# EAGLE schematic glbl2 (EAGLE 9.6.2)
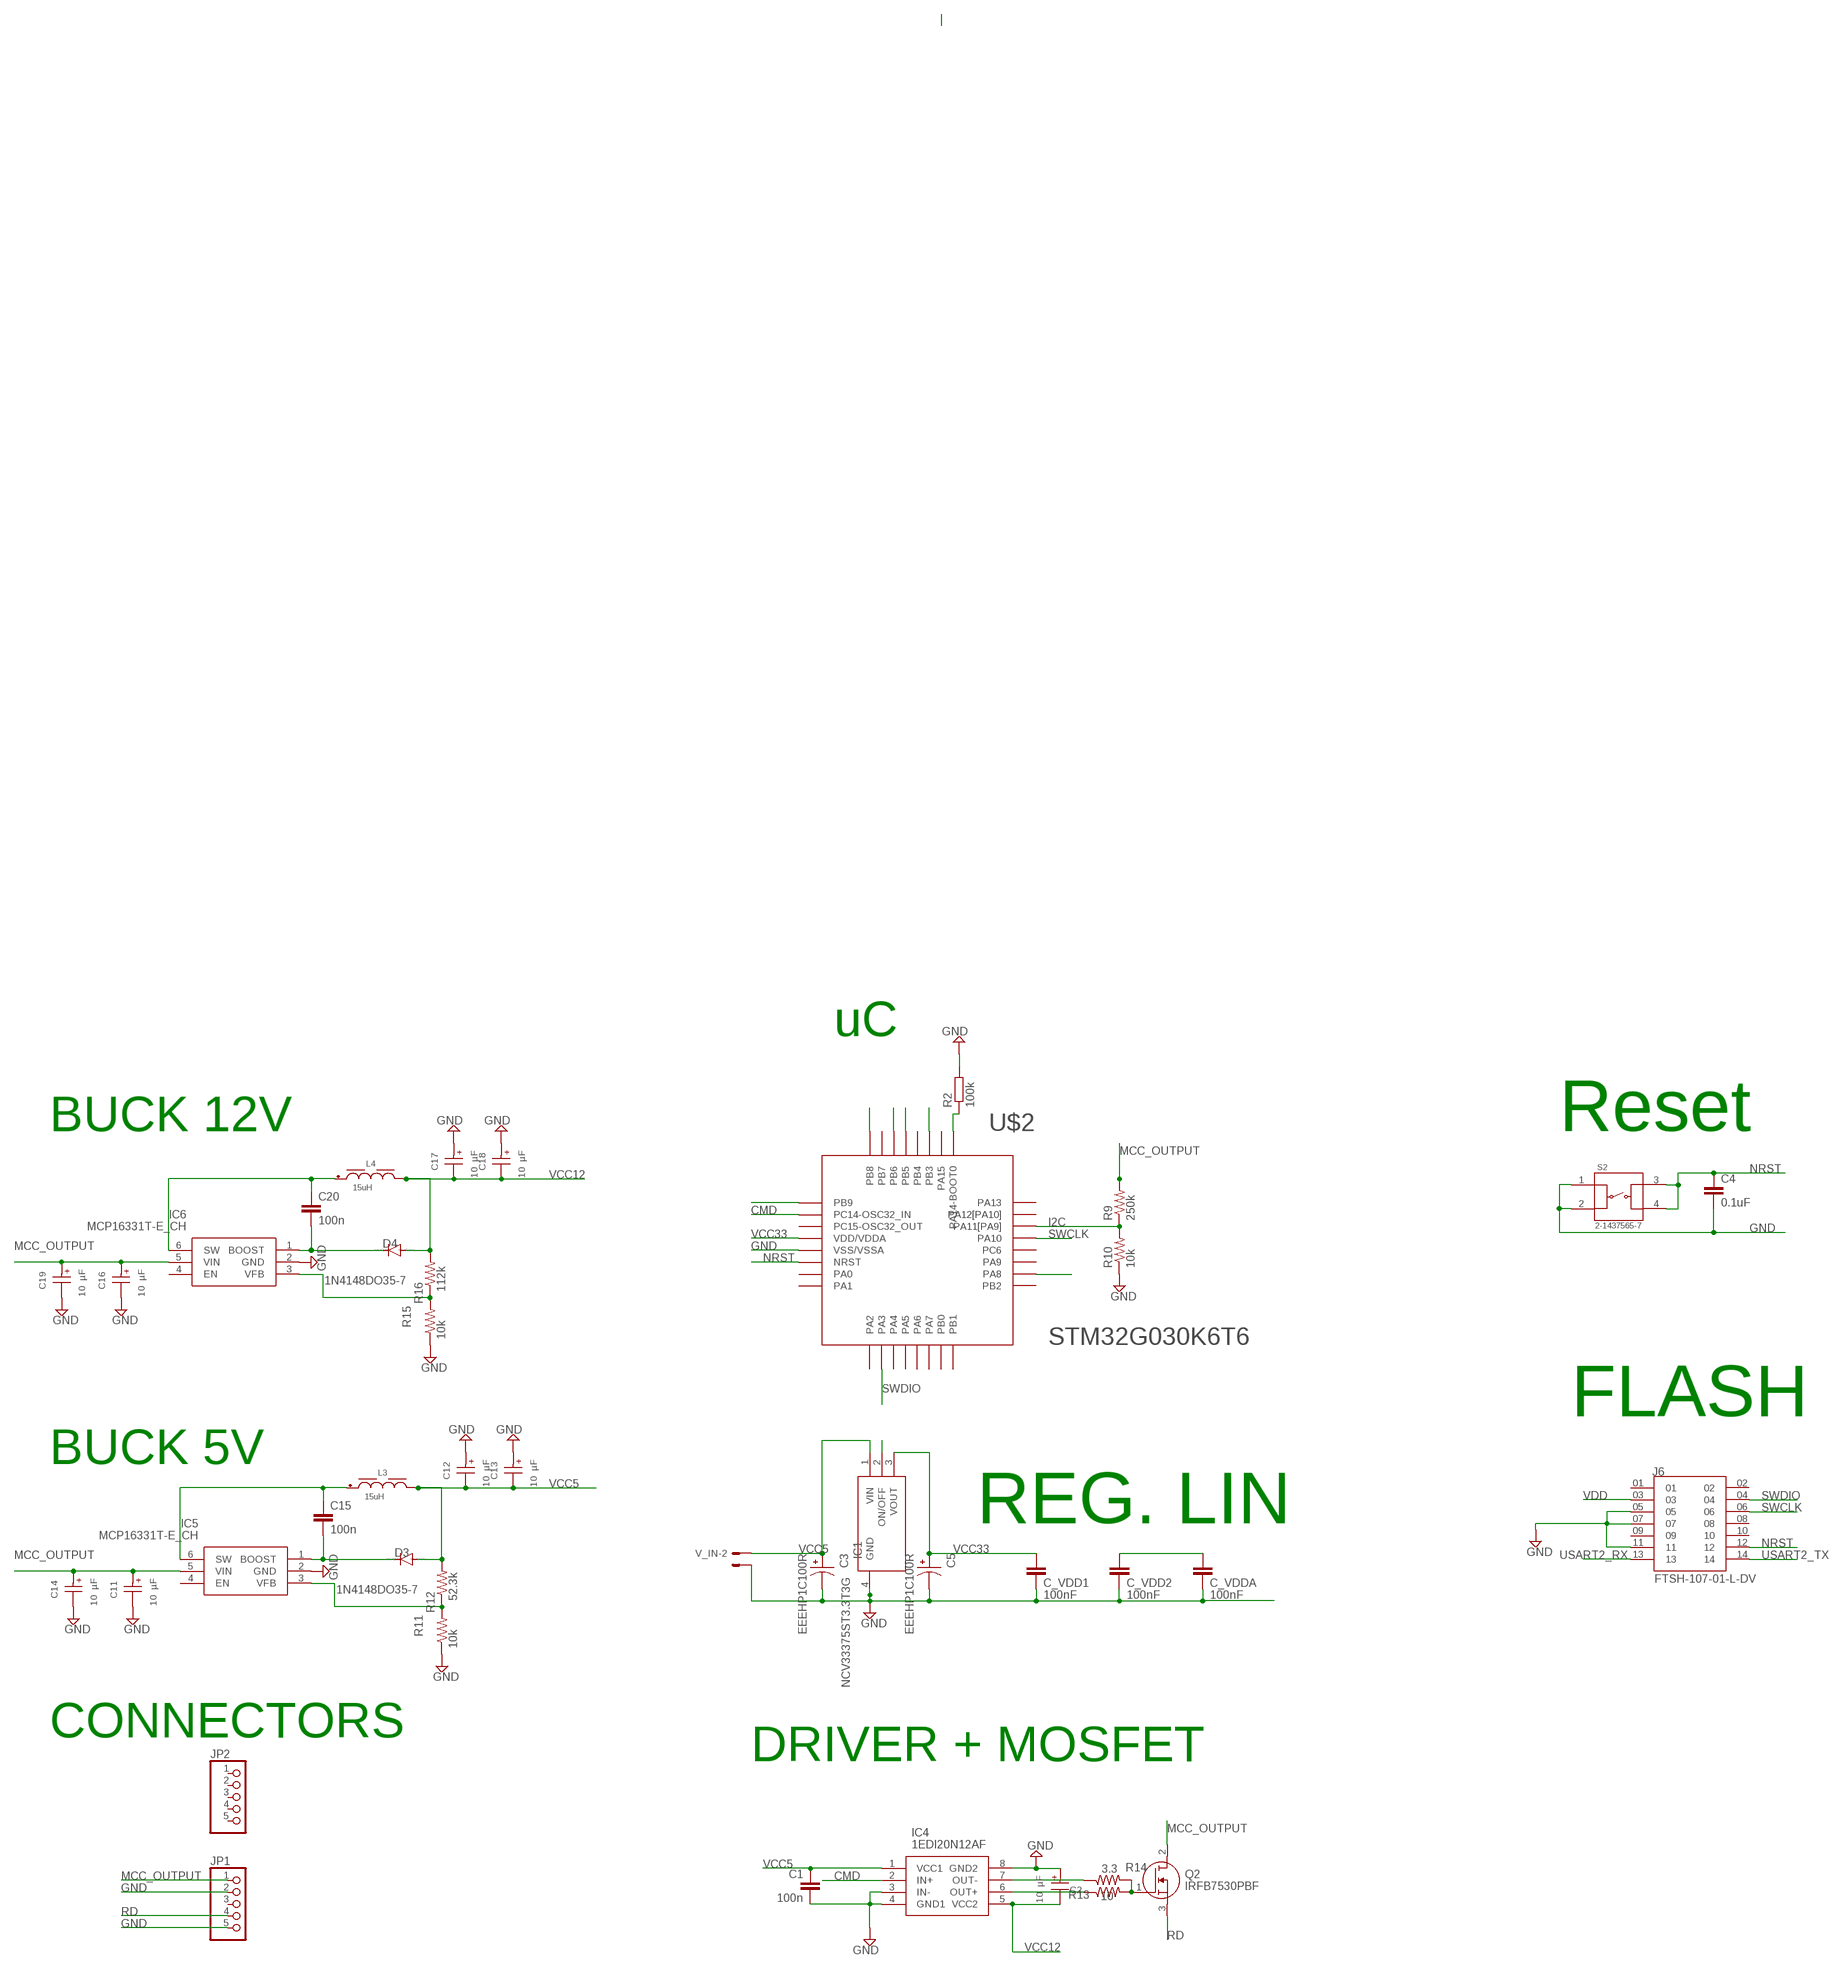
[diagram p0: schematic, sheet 1]

## Parts
C1  100n  C-EUC0805  [C0805]
C2  10 µF  WCAP-ASLI_6.3X7.7_865080845005  [WCAP-ASLI_6.3X7.7(DXL)]
C3  EEEHP1C100R  [CAP_EEEHP1C100R]
C4  0.1uF  C-EUC0603  [C0603]
C5  EEEHP1C100R  [CAP_EEEHP1C100R]
C11  10 µF  WCAP-ASLI_6.3X7.7_865080845005  [WCAP-ASLI_6.3X7.7(DXL)]
C12  10 µF  WCAP-ASLI_6.3X7.7_865080845005  [WCAP-ASLI_6.3X7.7(DXL)]
C13  10 µF  WCAP-ASLI_6.3X7.7_865080845005  [WCAP-ASLI_6.3X7.7(DXL)]
C14  10 µF  WCAP-ASLI_6.3X7.7_865080845005  [WCAP-ASLI_6.3X7.7(DXL)]
C15  100n  C-EUC0805  [C0805]
C16  10 µF  WCAP-ASLI_6.3X7.7_865080845005  [WCAP-ASLI_6.3X7.7(DXL)]
C17  10 µF  WCAP-ASLI_6.3X7.7_865080845005  [WCAP-ASLI_6.3X7.7(DXL)]
C18  10 µF  WCAP-ASLI_6.3X7.7_865080845005  [WCAP-ASLI_6.3X7.7(DXL)]
C19  10 µF  WCAP-ASLI_6.3X7.7_865080845005  [WCAP-ASLI_6.3X7.7(DXL)]
C20  100n  C-EUC0805  [C0805]
C_VDD1  100nF  C-EUC0603  [C0603]
C_VDD2  100nF  C-EUC0603  [C0603]
C_VDDA  100nF  C-EUC0603  [C0603]
D3  1N4148DO35-7  [DO35-7]
D4  1N4148DO35-7  [DO35-7]
IC1  NCV33375ST3.3T3G  [SOT230P700X175-4N]
IC4  1EDI20N12AF  [SOIC127P600X175-8N]
IC5  MCP16331T-E_CH  [SOT95P280X145-6N]
IC6  MCP16331T-E_CH  [SOT95P280X145-6N]
J6  FTSH-107-01-L-DV  [SAMTEC_FTSH-107-01-L-DV]
JP1  PINHD-1X5  [1X05]
JP2  PINHD-1X5  [1X05]
L3  15uH  WE-PD_7345R_7447779115  [WE-PD_7345R]
L4  15uH  WE-PD_7345R_7447779115  [WE-PD_7345R]
Q2  IRFB7530PBF  [TO254P483X1016X1994-3P]
R2  100k  R-EU_R0603  [R0603]
R9  250k  R-US_R0603  [R0603]
R10  10k  R-US_R0603  [R0603]
R11  10k  R-US_R0603  [R0603]
R12  52.3k  R-US_R0603  [R0603]
R13  10  R-US_R0603  [R0603]
R14  3.3  R-US_R0603  [R0603]
R15  10k  R-US_R0603  [R0603]
R16  112k  R-US_R0603  [R0603]
S2  2-1437565-7  [SW_2-1437565-7]
U$2  STM32G030K6T6  [QFP32_STM32]
V_IN  22-23-2021  [22-23-2021]

## Nets
CMD: IC4.2(IN+) U$2.2(PC14-OSC32_IN)
GND: C2.1(+) C3.2 C4.2 C5.2 C11.2(-) C12.1(+) C13.1(+) C14.2(-) C16.2(-) C17.1(+) C18.1(+) C19.2(-) C_VDD1.2 C_VDD2.2 C_VDDA.2 IC1.4(GND) IC4.3(IN-) IC4.8(GND2) IC5.2(GND) IC6.2(GND) J6.05 J6.07 J6.11 JP1.2 JP1.5 R2.2 R10.1 R11.1 R15.1 S2.1 S2.2 U$2.5(VSS/VSSA) V_IN.1
I2C: R9.1 R10.2 U$2.22(PA11[PA9])
MCC_OUTPUT: C11.1(+) C14.1(+) C16.1(+) C19.1(+) IC5.5(VIN) IC6.5(VIN) JP1.1 Q2.2(D) R9.2
N$1: IC4.6(OUT+) R13.1
N$2: IC4.7(OUT-) R14.1
N$5: IC1.2(ON/OFF)
N$6: C_VDD2.1 C_VDDA.1
N$7: C1.2 IC4.4(GND1)
N$8: U$2.27(PB3)
N$9: U$2.32(PB8)
N$10: U$2.29(PB5)
N$11: U$2.30(PB6)
N$12: U$2.1(PB9)
N$14: U$2.18(PA8)
N$15: R2.1 U$2.25(PA14-BOOT0)
N$17: C15.1 IC5.6(SW) L3.1
N$18: Q2.1(G) R13.2 R14.2
N$21: C15.2 D3.C IC5.1(BOOST)
N$22: IC5.3(VFB) R11.2 R12.1
N$27: C20.1 IC6.6(SW) L4.1
N$29: C20.2 D4.C IC6.1(BOOST)
N$30: IC6.3(VFB) R15.2 R16.1
NRST: C4.1 J6.12 S2.3 S2.4 U$2.6(NRST)
RD: JP1.4 Q2.3(S)
SWCLK: J6.06 U$2.21(PA10)
SWDIO: J6.04 U$2.10(PA3)
USART2_RX: J6.13
USART2_TX: J6.14
VCC5: C1.1 C3.1 C12.2(-) C13.2(-) D3.A IC1.1(VIN) IC4.1(VCC1) L3.2 R12.2 V_IN.2
VCC12: C2.2(-) C17.2(-) C18.2(-) D4.A IC4.5(VCC2) L4.2 R16.2
VCC33: C5.1 C_VDD1.1 IC1.3(VOUT) U$2.4(VDD/VDDA)
VDD: J6.03
Unconnected: IC5.4(EN) IC6.4(EN) J6.01 J6.02 J6.08 J6.09 J6.10 JP1.3 JP2.1 JP2.2 JP2.3 JP2.4 JP2.5 U$2.3(PC15-OSC32_OUT) U$2.7(PA0) U$2.8(PA1) U$2.9(PA2) U$2.11(PA4) U$2.12(PA5) U$2.13(PA6) U$2.14(PA7) U$2.15(PB0) U$2.16(PB1) U$2.17(PB2) U$2.19(PA9) U$2.20(PC6) U$2.23(PA12[PA10]) U$2.24(PA13) U$2.26(PA15) U$2.28(PB4) U$2.31(PB7)

## Notes on the sheet
- uC
- BUCK 12V | Reset
- FLASH
- BUCK 5V
- REG. LIN
- CONNECTORS
- DRIVER + MOSFET

## Library data of the parts
C1 C4 C15 C20 C_VDD1 C_VDD2 C_VDDA = rcl:C-EU: CAPACITOR, European symbol; SPICEPREFIX: C
C2 C11-C14 C16-C19 = Eagle_WCAP-ASLI (rev20a):WCAP-ASLI_6.3X7.7: WCAP-ASLI Aluminium Electrolytic Capacitors Low Impedance +105 °C Characteristics Low impedance product series Mounting style: V-Chip SMT Capacitance range: 0.1 µF ‒ 6800 µF Capacitance tolerance: ±20 % Voltage range (UR): 6.3 ‒ 100 V(DC) Operating temperature: -55 °C up to +105 °C Endurance: 2000 h @ +105 °C Dimensions (DxL) in mm: 4.0 x 5.5 up to 16.0 x 17.0 Recommended soldering: Reflow soldering Applications Low impedance, especially for filtering applications Input and output capacitor for switched-mode power supply Filtering Smoothing e.g. DC/DC converter, AC/DC converter, satellite receiver, control panel <https://www.we-online.com/catalog/media/o14723v209%20Family_WCAP-ASLI.jpg> Details see: https://www.we-online.com/catalog/en/WCAP-ASLI/ Updated by yingchun,Shan;2020-03-03 2020(C) Würth Elektronik; DATASHEET-URL: https://www.we-online.com/catalog/datasheet/865080845005.pdf; DF: 10%; DIAMETER: 6.3mm; I-LEAK: 10uA; I-RIPPLE: 35mA; L: 7.7mm; OPERATING-TEMPERATURE: -55 °C up to +105 °C; PART-NUMBER: 865080845005; TECHNICAL-REFERENCE: ASED077100M100DVCTCB000; VR: 100V(DC)
C3 C5 = EEEHP1C100R:EEEHP1C100R: Check availability <https://pricing.snapeda.com/parts/EEEHP1C100R/Panasonic/view-part?ref=eda>; AVAILABILITY: In Stock; DESCRIPTION: Cap Aluminum Lytic 10uF 16V 20% (5 X 5.8mm) SMD 25mA 2000h 105C Automotive T/R; MF: Panasonic; MP: EEEHP1C100R; PACKAGE: RADIAL-2 Panasonic; PRICE: None; PURCHASE-URL: https://pricing.snapeda.com/search/part/EEEHP1C100R/?ref=eda
D3 D4 = diode:1N4148: DIODE high speed (Philips)
IC1 = NCV33375ST3.3T3G:NCV33375ST3.3T3G: ON SEMICONDUCTOR - NCV33375ST3.3T3G - Fixed LDO Voltage Regulator, 4.3V to 13V, 260mV Dropout, 3.3Vout, 300mAout, SOT-223-4 Source: Datasheet <http://www.onsemi.com/pub/Collateral/MC33375-D.PDF>; ARROW_PART_NUMBER: NCV33375ST3.3T3G; ARROW_PRICE-STOCK: https://www.arrow.com/en/products/ncv33375st3.3t3g/on-semiconductor?region=nac; DESCRIPTION: ON SEMICONDUCTOR - NCV33375ST3.3T3G - Fixed LDO Voltage Regulator, 4.3V to 13V, 260mV Dropout, 3.3Vout, 300mAout, SOT-223-4; HEIGHT: 1.75mm; MANUFACTURER_NAME: onsemi; MANUFACTURER_PART_NUMBER: NCV33375ST3.3T3G; MOUSER_PART_NUMBER: 863-NCV33375ST3.3T3G; MOUSER_PRICE-STOCK: https://www.mouser.co.uk/ProductDetail/ON-Semiconductor/NCV33375ST33T3G?qs=Pqj8oIac8rWOl%252BM3OwXrOg%3D%3D
IC4 = 1EDI20N12AF:1EDI20N12AF: Gate Drivers 1200V Isolated 1-CH, 3.5A,Separate Output Source: Datasheet <https://componentsearchengine.com/Datasheets/1/1EDI20N12AF.pdf>; DESCRIPTION: Gate Drivers 1200V Isolated 1-CH, 3.5A,Separate Output; HEIGHT: 1.75mm; MANUFACTURER_NAME: Infineon; MANUFACTURER_PART_NUMBER: 1EDI20N12AF; MOUSER_PART_NUMBER: 726-1EDI20N12AF; MOUSER_PRICE-STOCK: https://www.mouser.co.uk/ProductDetail/Infineon-Technologies/1EDI20N12AF?qs=Fdzd9GSp%252BASr8JSo1G1nbg%3D%3D
IC5 IC6 = MCP16331T-E_CH:MCP16331T-E_CH: 50V 500mA Adj. Switch Regulator SOT23-6 Microchip, MCP16331T-E/CH Step-Down Switching Regulator 1.2A Adjustable, 2 24 V, 6-Pin SOT-23 Source: Datasheet <http://ww1.microchip.com/downloads/en/DeviceDoc/20005308C.pdf>; ARROW_PART_NUMBER: MCP16331T-E/CH; ARROW_PRICE-STOCK: https://www.arrow.com/en/products/mcp16331t-ech/microchip-technology?region=nac; DESCRIPTION: 50V 500mA Adj. Switch Regulator SOT23-6 Microchip, MCP16331T-E/CH Step-Down Switching Regulator 1.2A Adjustable, 2 24 V, 6-Pin SOT-23; HEIGHT: 1.45mm; MANUFACTURER_NAME: Microchip; MANUFACTURER_PART_NUMBER: MCP16331T-E/CH; MOUSER_PART_NUMBER: 579-MCP16331T-E/CH; MOUSER_PRICE-STOCK: https://www.mouser.co.uk/ProductDetail/Microchip-Technology/MCP16331T-E-CH?qs=rQCxX1QmdjIpfF%2FjMAUv9A%3D%3D
J6 = FTSH-107-01-L-DV:FTSH-107-01-L-DV; MANUFACTURER: Samtec; PARTREV: R; STANDARD: Manufacturer Recommendations
JP1 JP2 = pinhead:PINHD-1X5: PIN HEADER
L3 L4 = Eagle_WE-PD (rev20a)(1):WE-PD_7345R: WE-PD SMT Power Inductor Characteristics AECQ 200 Qualified Ultra low RDC and RAC Highest possible saturation current based on Ferrite Suitable for switching frequency up to 10MHz Temperature dependent parameter available on Redexpert Operating Temperature from -40°C to +125°C / +150°C Types WE-PD: Since always with low loss material, tight tolerances and high saturation behavior compared to other manufacturers in the market WE-PD Robust: Plastic base improves the mechanical stability and efficiency WE-PD Performance: MnZn core improves Saturation and RDC for highest efficiency Applications Switch Mode Power supplies from 0,1W up to 300W Integrated DC DC Converter Ideal for Switch Mode Power supplies with extreme high efficiency (>95%) <https://www.we-online.com/catalog/media/o14825v209%20Family_WE-PD.jpg> Details see: https://www.we-online.com/catalog/en/WE-PD/ Updated by Yingchun,Shan 2019-07-25 2019 (C) Wurth Elektronik; DATASHEET-URL: https://www.we-online.com/catalog/datasheet/7447779115.pdf; FRES: 19.5MHz; IR: 1.6A; ISAT: 2.2A; MOUNT: SMT; PART-NUMBER: 7447779115; RDC-MAX: 81mOhm; RDC-TYP: 70mOhm; VERSION: Robust
Q2 = IRFB7530PBF:IRFB7530PBF: Infineon IRFB7530PBF N-channel MOSFET, 195 A, 60 V StrongIRFET, 3-Pin TO-220AB Source: Datasheet <https://www.infineon.com/dgdl/irfs7530pbf.pdf?fileId=5546d462533600a4015364c3d98429c3>; ARROW_PART_NUMBER: IRFB7530PBF; ARROW_PRICE-STOCK: https://www.arrow.com/en/products/irfb7530pbf/infineon-technologies-ag; DESCRIPTION: Infineon IRFB7530PBF N-channel MOSFET, 195 A, 60 V StrongIRFET, 3-Pin TO-220AB; HEIGHT: 4.83mm; MANUFACTURER_NAME: Infineon; MANUFACTURER_PART_NUMBER: IRFB7530PBF; MOUSER_PART_NUMBER: 942-IRFB7530PBF; MOUSER_PRICE-STOCK: https://www.mouser.co.uk/ProductDetail/Infineon-IR/IRFB7530PBF?qs=a7rcPCEf1Q%2FFGrR%252BNclv%2FQ%3D%3D
R2 = rcl:R-EU_: RESISTOR, European symbol; SPICEPREFIX: R
R9-R16 = rcl:R-US_: RESISTOR, American symbol; SPICEPREFIX: R
S2 = 2-1437565-7:2-1437565-7: FSM2JSMA=SMT,TACTILE,PB SWITCH Check availability <https://pricing.snapeda.com/parts/FSM2JSMA/TE%20Connectivity/view-part?ref=eda>; AVAILABILITY: In Stock; COMMENT: 2-1437565-7; CONFIGURATION_POLE-THROW: Single Pole - Single Throw; CONTACT_CURRENT_RATING: 50 mA; DESCRIPTION: Tactile Switch SPST-NO Top Actuated Surface Mount; MF: TE Connectivity; MP: FSM2JSMA; PACKAGE: None; PRICE: None; PURCHASE-URL: https://pricing.snapeda.com/search/part/FSM2JSMA/?ref=eda
U$2 = STM32G030K6T6:STM32G030K6T6: STM32G030K6T6 32 pins LQFP Check availability <https://pricing.snapeda.com/parts/STM32G030K6T6/STMicroelectronics/view-part?ref=eda>; AVAILABILITY: In Stock; DESCRIPTION: ARM® Cortex®-M0+ series Microcontroller IC 32-Bit Single-Core 64MHz 32KB (32K x 8) FLASH 32-LQFP (7x7); MF: STMicroelectronics; MP: STM32G030K6T6; PACKAGE: LQFP-32 STMicroelectronics; PRICE: None; PURCHASE-URL: https://pricing.snapeda.com/search/part/STM32G030K6T6/?ref=eda
V_IN = con-molex:22-23-2021: .100" (2.54mm) Center Header - 2 Pin; MF: MOLEX; MPN: 22-23-2021; OC_FARNELL: 1462926; OC_NEWARK: 25C3832